# Altium schematic sheet motor.SchDoc
size A3
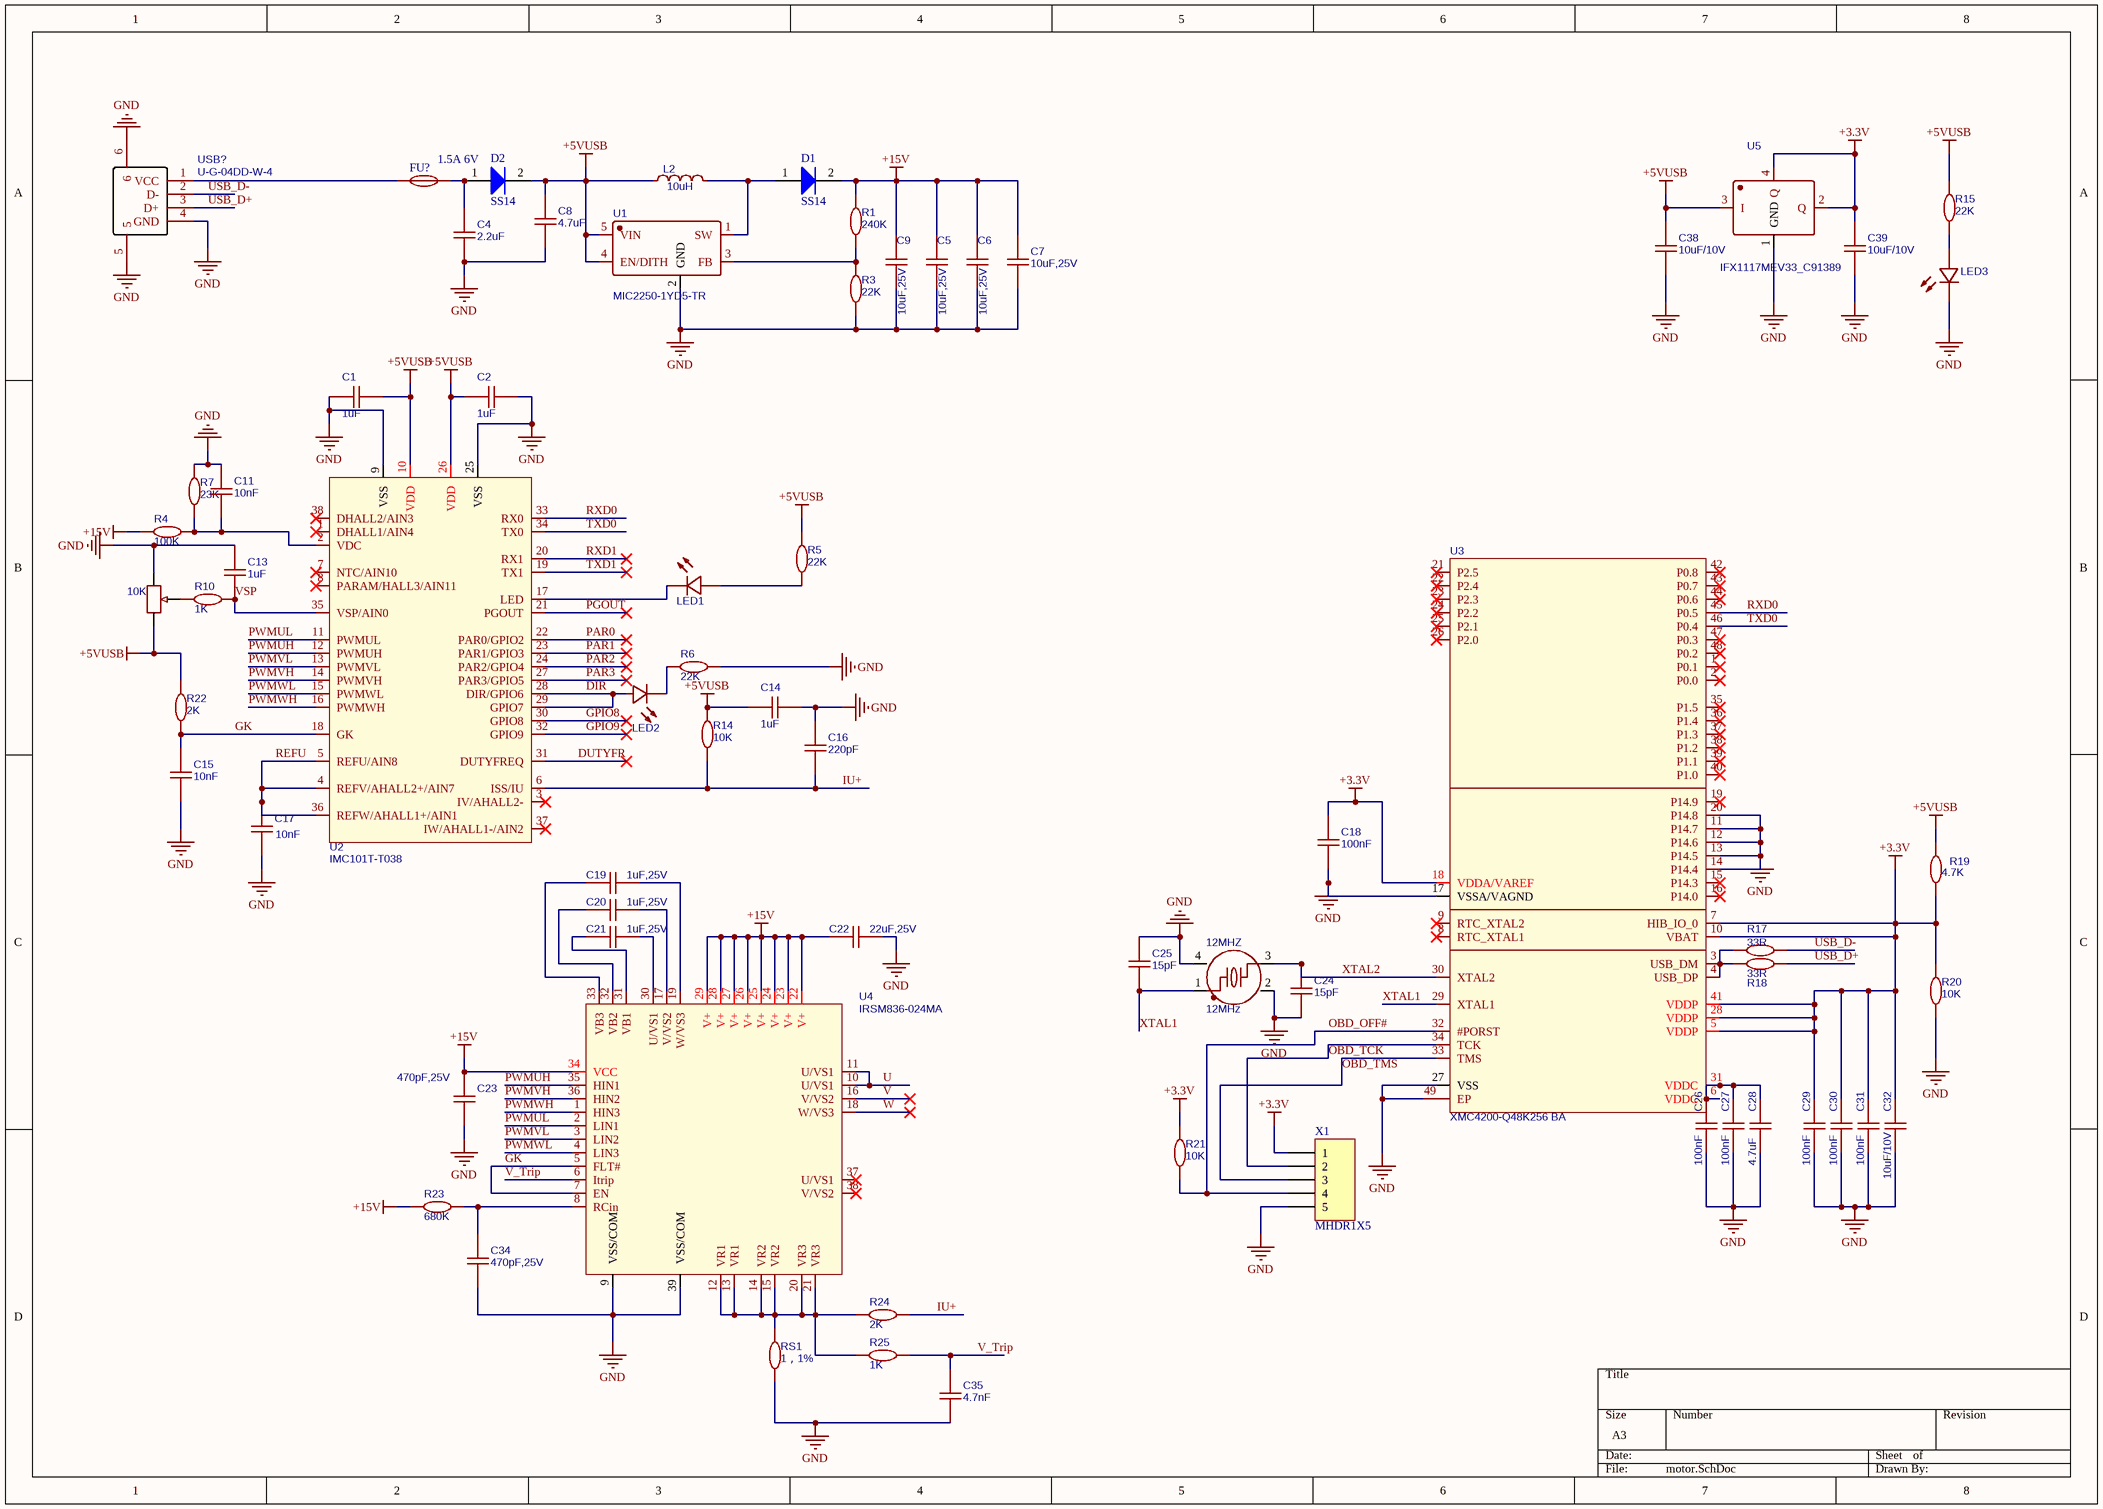
[diagram p0: motor.SchDoc]

## Parts
12MHZ  12MHz  [12MHZ   C481407]
?  10K  [可调电阻]
C1  1uF  [C0603]
C2  1uF  [C0603]
C4  2.2uF  [C0603]
C5  10uF,25V  [C0603]
C6  10uF,25V  [C0603]
C7  10uF,25V  [C0603]
C8  4.7uF  [C0603]
C9  10uF,25V  [C0603]
C11  10nF  [C0603]
C13  1uF  [C0603]
C14  1uF  [C0603]
C15  10nF  [C0603]
C16  220pF  [C0603]
C17  10nF  [C0603]
C18  100nF  [C0603]
C19  1uF,25V  [C0603]
C20  1uF,25V  [C0603]
C21  1uF,25V  [C0603]
C22  22uF,25V  [C0603]
C23  470pF,25V  [C0603]
C24  15pF  [C0603]
C25  15pF  [C0603]
C26  100nF  [C0603]
C27  100nF  [C0603]
C28  4.7uF  [C0603]
C29  100nF  [C0603]
C30  100nF  [C0603]
C31  100nF  [C0603]
C32  10uF/10V  [C0603]
C34  470pF,25V  [C0603]
C35  4.7nF  [C0603]
C38  10uF/10V  [C0603]
C39  10uF/10V  [C0603]
D1  SS14  [DO-214AA]
D2  SS14  [DO-214AA]
FU?  1.5A 6V  [1206]
L2  10uH  [电感L0603]
LED1  LED  [LED0603-R-RD]  (value not drawn)
LED2  LED  [LED0603-R-RD]  (value not drawn)
LED3  LED  [LED0603-R-RD]  (value not drawn)
R1  240K  [R0603]
R3  22K  [R0603]
R4  100K  [R0603]
R5  22K  [R0603]
R6  22K  [R0603]
R7  23K  [R0603]
R10  1K  [R0603]
R14  10K  [R0603]
R15  22K  [R0603]
R17  33R  [R0603]
R18  33R  [R0603]
R19  4.7K  [R0603]
R20  10K  [R0603]
R21  10K  [R0603]
R22  2K  [R0603]
R23  680K  [R0603]
R24  2K  [R0603]
R25  1K  [R0603]
RS1  1，1%  [R0603]
U1  MIC2250-1YD5-TR  [MIC2250-1YD5-TR]
U2  IMC101T-T038  [IMC101T-T038]
U3  XMC4200-Q48K256 BA  [XMC4200-Q48K256 BA]
U4  IRSM836-024MA  [IRSM836-024MA]
U5  IFX1117MEV33_C91389  [IFX1117ME V33]
USB?  U-G-04DD-W-4  [USB-TH_U-G-04DD-W-4]
X1  MHDR1X5  [MHDR1X5]

## Nets
+3.3V: C18.2 C29.1 C30.1 C31.1 C32.1 C39.2 R19.1 R20.2 R21.2 U3.5(VDDP) U3.7(HIB_IO_0) U3.10(VBAT) U3.18(VDDA/VAREF) U3.28(VDDP) U3.41(VDDP) U5.2(Q) U5.4(Q) X1.1
+5VUSB: ?.3 C1.1 C2.2 C8.2 C14.1 C38.2 D2.2(K) L2.1 R5.2 R14.1 R15.2 R19.2 R22.1 U1.4(EN/DITH) U1.5(VIN) U2.10(VDD) U2.26(VDD) U5.3(I)
+15V: C5.2 C6.2 C7.2 C9.2 C22.2 C23.2 D1.2(K) R1.2 R4.2 R23.2 U4.22(V+) U4.23(V+) U4.24(V+) U4.25(V+) U4.26(V+) U4.27(V+) U4.28(V+) U4.29(V+) U4.34(VCC)
GND: 12MHZ.2(GND) 12MHZ.4(GND) ?.1 C1.2 C2.1 C4.1 C5.1 C6.1 C7.1 C8.1 C9.1 C11.2 C13.2 C14.2 C15.1 C16.2 C17.1 C18.1 C22.1 C23.1 C24.1 C25.2 C26.2 C27.2 C28.2 C29.2 C30.2 C31.2 C32.2 C34.1 C35.1 C38.1 C39.1 LED3.2 R3.1 R6.1 R7.1 R20.1 RS1.2 U1.2(GND) U2.9(VSS) U2.25(VSS) U3.11(P14.7) U3.12(P14.6) U3.13(P14.5) U3.14(P14.4) U3.17(VSSA/VAGND) U3.20(P14.8) U3.27(VSS) U3.49(EP) U4.9(VSS/COM) U4.39(VSS/COM) U5.1(GND) USB?.4(GND) USB?.5 USB?.6 X1.5
DIR: LED2.1 U2.28(DIR/GPIO6) U2.29(GPIO7)
DUTYFR: U2.31(DUTYFREQ)
GK: C15.2 R22.2 U2.18(GK) U4.5(FLT#) U4.7(EN)
GPIO8: U2.30(GPIO8)
GPIO9: U2.32(GPIO9)
IU+: C16.1 R14.2 R24.1 U2.6(ISS/IU)
OBD_OFF#: R21.1 U3.32(#PORST) X1.4
OBD_TCK: U3.34(TCK) X1.2
OBD_TMS: U3.33(TMS) X1.3
PAR0: U2.22(PAR0/GPIO2)
PAR1: U2.23(PAR1/GPIO3)
PAR2: U2.24(PAR2/GPIO4)
PAR3: U2.27(PAR3/GPIO5)
PGOUT: U2.21(PGOUT)
PWMUH: U2.12(PWMUH) U4.35(HIN1)
PWMUL: U2.11(PWMUL) U4.2(LIN1)
PWMVH: U2.14(PWMVH) U4.36(HIN2)
PWMVL: U2.13(PWMVL) U4.3(LIN2)
PWMWH: U2.16(PWMWH) U4.1(HIN3)
PWMWL: U2.15(PWMWL) U4.4(LIN3)
REFU: C17.2 U2.4(REFV/AHALL2+/AIN7) U2.5(REFU/AIN8) U2.36(REFW/AHALL1+/AIN1)
RXD0: U2.33(RX0) U3.45(P0.5)
RXD1: U2.20(RX1)
TXD0: U2.34(TX0) U3.46(P0.4)
TXD1: U2.19(TX1)
U: U4.10(U/VS1) U4.11(U/VS1)
USB_D+: R18.2 USB?.3(D+)
USB_D-: R17.2 USB?.2(D-)
V: U4.16(V/VS2)
V_Trip: C35.2 R25.1 U4.6(Itrip)
VSP: C13.1 R10.1 U2.35(VSP/AIN0)
W: U4.18(W/VS3)
XTAL1: 12MHZ.1 C25.1 U3.29(XTAL1)
XTAL2: 12MHZ.3 C24.2 U3.30(XTAL2)
Net?_2: ?.2 R10.2
NetC4_2: C4.2 D2.1(A) FU?.1
NetC11_1: C11.1 R4.1 R7.2 U2.2(VDC)
NetC19_1: C19.1 U4.33(VB3)
NetC19_2: C19.2 U4.19(W/VS3)
NetC20_1: C20.1 U4.17(V/VS2)
NetC20_2: C20.2 U4.32(VB2)
NetC21_1: C21.1 U4.30(U/VS1)
NetC21_2: C21.2 U4.31(VB1)
NetC26_1: C26.1 C27.1 C28.1 U3.6(VDDC) U3.31(VDDC)
NetC34_2: C34.2 R23.1 U4.8(RCin)
NetD1_1: D1.1(A) L2.2 U1.1(SW)
NetFU?_2: FU?.2 USB?.1(VCC)
NetLED1_1: LED1.1 R5.1
NetLED1_2: LED1.2 U2.17(LED)
NetLED2_2: LED2.2 R6.2
NetLED3_1: LED3.1 R15.1
NetR1_1: R1.1 R3.2 U1.3(FB)
NetR17_1: R17.1 R18.1 U3.3(USB_DM) U3.4(USB_DP)
NetR24_2: R24.2 R25.2 RS1.1 U4.12(VR1) U4.13(VR1) U4.14(VR2) U4.15(VR2) U4.20(VR3) U4.21(VR3)

Not connected (* = marked no-connect by the designer): U2 1(DHALL1/AIN4)* 3(IV/AHALL2-)* 7(NTC/AIN10)* 8(PARAM/HALL3/AIN11)* 37(IW/AHALL1-/AIN2)* 38(DHALL2/AIN3)*; U3 1(P0.1)* 2(P0.0)* 8(RTC_XTAL1)* 9(RTC_XTAL2)* 15(P14.3)* 16(P14.0)* 19(P14.9)* 21(P2.5)* 22(P2.4)* 23(P2.3)* 24(P2.2)* 25(P2.1)* 26(P2.0)* 35(P1.5)* 36(P1.4)* 37(P1.3)* 38(P1.2)* 39(P1.1)* 40(P1.0)* 42(P0.8)* 43(P0.7)* 44(P0.6)* 47(P0.3)* 48(P0.2)*; U4 37(U/VS1)* 38(V/VS2)*

## Library data of the parts
12MHZ = 12MHz: BOM_Manufacturer: NDK; BOM_Manufacturer Part: NX3225GA-12MHZ-STD-CRG-2; nameAlias: Frequency; Contributor: LCSC; BOM_Supplier: LCSC; BOM_Supplier Part: C481407; BOM_JLCPCB Part Class: Extended Part; spicePre: X; spiceSymbolName: NX3225GA-12MHZ-STD-CRG-2
? = 可调电阻R?: BOM_Manufacturer: Nidec Copal Elec; nameAlias: Resistance (Ohms); Contributor: LCSC; BOM_Supplier: LCSC; BOM_Supplier Part: C132891; BOM_Manufacturer Part: -; Resistance(Ohms): 10K; BOM_JLCPCB Part Class: Extended Part; spicePre: R; spiceSymbolName: ST-32EA 10K ohm (103)
C1 C2 C4-C9 C11 C13-C32 C34 C35 C38 C39 = 100nF: BOM_Manufacturer: SAMSUNG; BOM_Manufacturer Part: CL10B104KC8NNNC; nameAlias: Capacitance; BOM_Supplier: LCSC; BOM_Supplier Part: C15725; BOM_JLCPCB Part Class: Extended Part; spicePre: C; spiceSymbolName: CL10B104KC8NNNC
D1 D2 = Diode: Default Diode; Published: 8-Jun-2000; LatestRevisionDate: 17-Jul-2002; LatestRevisionNote: Re-released for DXP Platform.; PackageVersion: Sep-1996; PackageReference: SMC; Publisher: Altium Limited; PackageDescription: DO-214-AB/SMC; 2 C-Bend Leads; Body 7.9 x 5.9 mm, inc. leads (LxW); Code_JEDEC: DO-214-AB
FU? = FU
L2 = 10uH: BOM_Manufacturer: Chilisin Elec; BOM_Manufacturer Part: LS0603-100K-N; nameAlias: Inductance; Contributor: LCSC; BOM_Supplier: LCSC; BOM_Supplier Part: C285886; spicePre: L; spiceSymbolName: LS0603-100K-N
LED1-LED3 = LED: BOM_Manufacturer: Everlight Elec; BOM_Manufacturer Part: 19-213/R6W-BP2Q2B/3T; Contributor: LCSC; BOM_Supplier: LCSC; BOM_Supplier Part: C181863; BOM_JLCPCB Part Class: Extended Part; spicePre: L; spiceSymbolName: 19-213/R6W-BP2Q2B/3T
R1 R3-R7 R10 R14 R15 R17-R25 RS1 = 1M: BOM_Manufacturer: Huaxin S&T; BOM_Manufacturer Part: MR06X105JTL; nameAlias: Resistance (Ohms); Contributor: LCSC; BOM_Supplier: LCSC; BOM_Supplier Part: C327832; spicePre: R; spiceSymbolName: MR06X105JTL
U1 = MIC2250-1YD5-TR: BOM_Manufacturer: Microchip Tech; Contributor: LCSC; BOM_Supplier: LCSC; BOM_Supplier Part: C511328; BOM_Manufacturer Part: MIC2250-1YD5-TR; BOM_JLCPCB Part Class: Extended Part; spicePre: U; spiceSymbolName: MIC2250-1YD5-TR
U2 = IMC101T-T038: BOM_Manufacturer: Infineon Technologies; Contributor: LCSC; BOM_Supplier: LCSC; BOM_Supplier Part: C536267; BOM_Manufacturer Part: IMC101T-T038; BOM_JLCPCB Part Class: Extended Part; spicePre: U; spiceSymbolName: IMC101T-T038
U3 = XMC4200-Q48K256 BA: BOM_Manufacturer: Infineon Technologies; Contributor: LCSC; BOM_Supplier: LCSC; BOM_Supplier Part: C540631; BOM_Manufacturer Part: XMC4200-Q48K256 BA; BOM_JLCPCB Part Class: Extended Part; spicePre: U; spiceSymbolName: XMC4200-Q48K256 BA
U4 = IRSM836-024MA: BOM_Manufacturer: Infineon Technologies; Contributor: LCSC; BOM_Supplier: LCSC; BOM_Supplier Part: C538420; BOM_Manufacturer Part: IRSM836-024MA; BOM_JLCPCB Part Class: Extended Part; spicePre: U; spiceSymbolName: IRSM836-024MA
U5 = IFX1117MEV33_C91389: BOM_Manufacturer: Infineon Technologies; Contributor: 立创EDA官方封装库; BOM_Supplier: LCSC; BOM_Supplier Part: C91389; BOM_Manufacturer Part: IFX1117MEV33; BOM_JLCPCB Part Class: Extended Part; spicePre: U; spiceSymbolName: IFX1117MEV33_C91389
USB? = usb2.0: BOM_Manufacturer: Korean Hroparts Elec; Contributor: LCSC; BOM_Supplier: LCSC; BOM_Supplier Part: C879731; BOM_Manufacturer Part: U-G-04DD-W-4; BOM_JLCPCB Part Class: Extended Part; spicePre: U; spiceSymbolName: U-G-04DD-W-4
X1 = MHDR1X5: Header, 5-Pin; LatestRevisionDate: 17-Jul-2002; LatestRevisionNote: Re-released for DXP Platform.; Publisher: Altium Limited